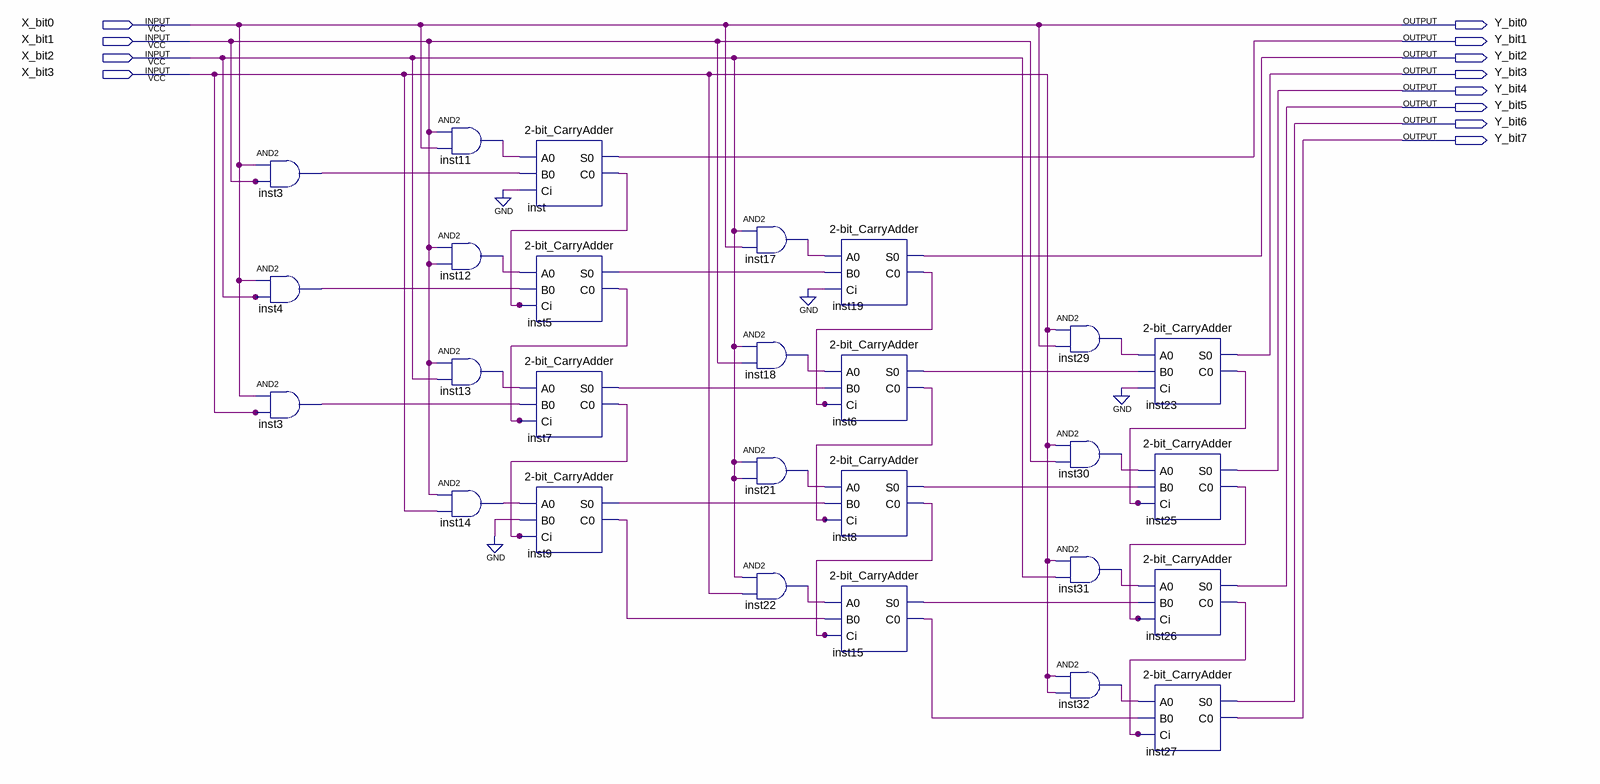
[diagram p0: schematic sheet]
// Quartus schematic HW1_P3.bdf as structural Verilog: 27 symbols, 12 pins
module HW1_P3 (
  input  X_bit0,
  input  X_bit1,
  input  X_bit2,
  input  X_bit3,
  output Y_bit0,
  output Y_bit1,
  output Y_bit2,
  output Y_bit3,
  output Y_bit4,
  output Y_bit5,
  output Y_bit6,
  output Y_bit7
);

  wire inst3_out, inst3_out_2, inst4_out, inst5_c0, inst5_s0, inst6_c0, inst6_s0, inst7_c0, inst7_s0,
       inst8_c0, inst8_s0, inst9_c0, inst9_s0, inst11_out, inst12_out, inst13_out, inst14_out, inst15_c0,
       inst15_s0, inst17_out, inst18_out, inst19_c0, inst21_out, inst22_out, inst23_c0, inst25_c0, inst26_c0,
       inst29_out, inst30_out, inst31_out, inst32_out, inst_c0;

  and inst3 (inst3_out, X_bit0, X_bit1);
  and inst4 (inst4_out, X_bit0, X_bit2);
  and inst3_dup2 (inst3_out_2, X_bit0, X_bit3);
  and inst11 (inst11_out, X_bit1, X_bit0);
  and inst12 (inst12_out, X_bit1, X_bit1);
  and inst13 (inst13_out, X_bit1, X_bit2);
  and inst14 (inst14_out, X_bit1, X_bit3);
  \2-bit_CarryAdder  inst (.A0(inst11_out), .B0(inst3_out), .Ci(1'b0), .S0(Y_bit1), .C0(inst_c0));
  \2-bit_CarryAdder  inst5 (.A0(inst12_out), .B0(inst4_out), .Ci(inst_c0), .S0(inst5_s0), .C0(inst5_c0));
  \2-bit_CarryAdder  inst7 (.A0(inst13_out), .B0(inst3_out_2), .Ci(inst5_c0), .S0(inst7_s0), .C0(inst7_c0));
  \2-bit_CarryAdder  inst9 (.A0(inst14_out), .B0(1'b0), .Ci(inst7_c0), .S0(inst9_s0), .C0(inst9_c0));
  and inst17 (inst17_out, X_bit2, X_bit0);
  and inst18 (inst18_out, X_bit2, X_bit1);
  and inst21 (inst21_out, X_bit2, X_bit2);
  and inst22 (inst22_out, X_bit2, X_bit3);
  \2-bit_CarryAdder  inst19 (.A0(inst17_out), .B0(inst5_s0), .Ci(1'b0), .S0(Y_bit2), .C0(inst19_c0));
  \2-bit_CarryAdder  inst6 (.A0(inst18_out), .B0(inst7_s0), .Ci(inst19_c0), .S0(inst6_s0), .C0(inst6_c0));
  \2-bit_CarryAdder  inst8 (.A0(inst21_out), .B0(inst9_s0), .Ci(inst6_c0), .S0(inst8_s0), .C0(inst8_c0));
  \2-bit_CarryAdder  inst15 (.A0(inst22_out), .B0(inst9_c0), .Ci(inst8_c0), .S0(inst15_s0), .C0(inst15_c0));
  and inst29 (inst29_out, X_bit3, X_bit0);
  and inst30 (inst30_out, X_bit3, X_bit1);
  and inst31 (inst31_out, X_bit3, X_bit2);
  and inst32 (inst32_out, X_bit3, X_bit3);
  \2-bit_CarryAdder  inst23 (.A0(inst29_out), .B0(inst6_s0), .Ci(1'b0), .S0(Y_bit3), .C0(inst23_c0));
  \2-bit_CarryAdder  inst25 (.A0(inst30_out), .B0(inst8_s0), .Ci(inst23_c0), .S0(Y_bit4), .C0(inst25_c0));
  \2-bit_CarryAdder  inst26 (.A0(inst31_out), .B0(inst15_s0), .Ci(inst25_c0), .S0(Y_bit5), .C0(inst26_c0));
  \2-bit_CarryAdder  inst27 (.A0(inst32_out), .B0(inst15_c0), .Ci(inst26_c0), .S0(Y_bit6), .C0(Y_bit7));

  assign Y_bit0 = X_bit0;
endmodule
